# EAGLE schematic DevBit-MAX30102 (EAGLE 7.3.0)
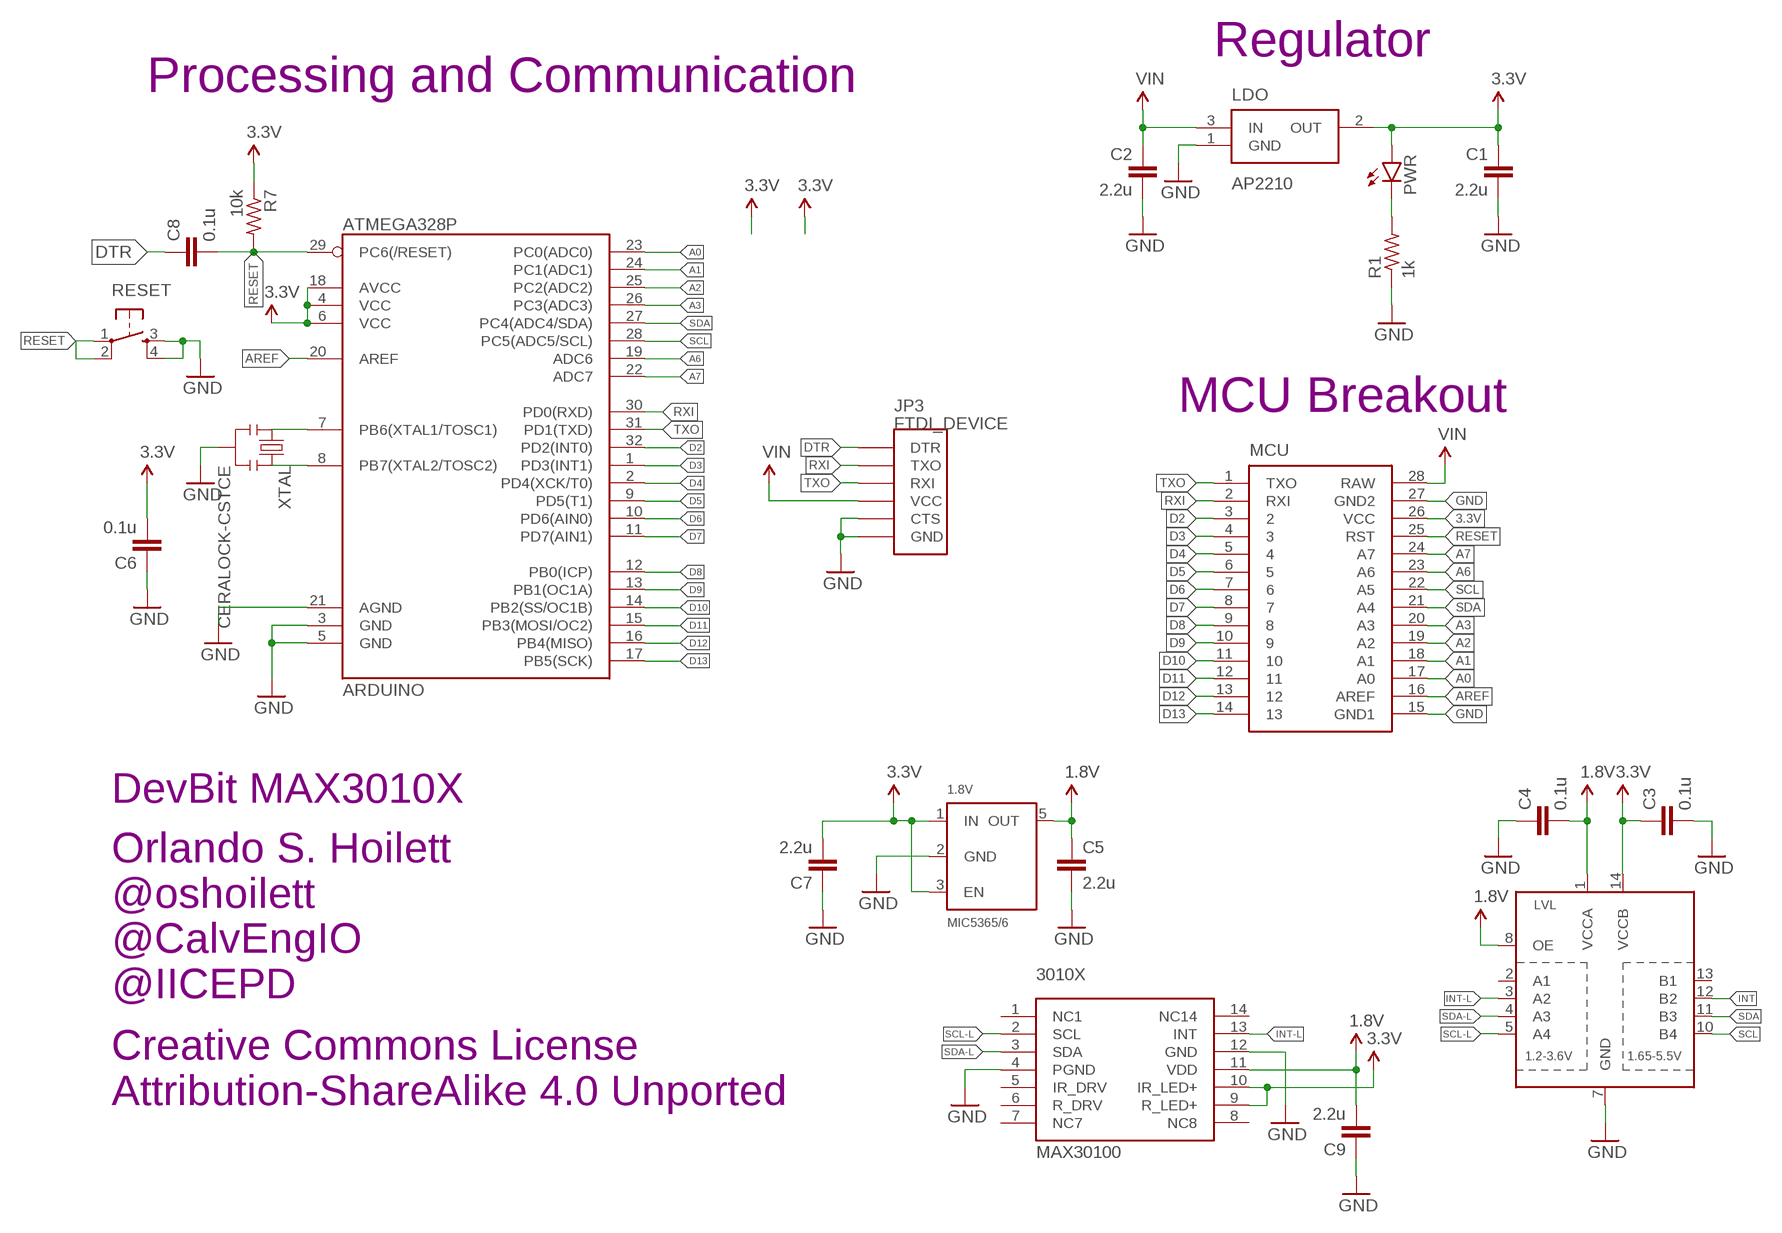
[diagram p0: schematic, sheet 1]

## Parts
1.8V  MIC5365/6  [SC-70-5]
3010X  MAX30100  [OESIP14]
ARDUINO  ATMEGA328P  ATMEGA328_SMT-OHMOD  [TQFP32-08]
C1  2.2u  C-EUC0402  [C0402]
C2  2.2u  C-EUC0402  [C0402]
C3  0.1u  C-EUC0402  [C0402]
C4  0.1u  C-EUC0402  [C0402]
C5  2.2u  C-EUC0402  [C0402]
C6  0.1u  C-EUC0402  [C0402]
C7  2.2u  C-EUC0402  [C0402]
C8  0.1u  C-EUC0402  [C0402]
C9  2.2u  C-EUC0402  [C0402]
JP3  FTDI_DEVICE  [FTDI_DEVICE]
LDO  AP2210  [SOT23]
LVL  TXB0104PWR  [TSSOP14]
MCU  DEVBASIC-V1  [DEVBIT-BASIC-V1]
PWR  LED0603  [LED-0603]
R1  1k  R-US_R0402  [R0402]
R7  10k  R-US_R0402  [R0402]
RESET  BUTTON-PTS830GG140  [BUTTON-GULLWING]
XTAL  CERALOCK-CSTCE  [RESONATOR-00]

## Nets
1.8V: 1.8V.5(OUT) 3010X.11(VDD) C4.2 C5.1 C9.2 LVL.1(VCCA) LVL.8(OE)
3.3V: 1.8V.1(IN) 1.8V.3(EN) 3010X.9(R_LED+) 3010X.10(IR_LED+) ARDUINO.4(VCC) ARDUINO.6(VCC) ARDUINO.18(AVCC) C1.1 C3.1 C6.2 C7.2 LDO.2(OUT) LVL.14(VCCB) MCU.26(VCC) PWR.A R7.1
A0: ARDUINO.23(PC0(ADC0)) MCU.17(A0)
A1: ARDUINO.24(PC1(ADC1)) MCU.18(A1)
A2: ARDUINO.25(PC2(ADC2)) MCU.19(A2)
A3: ARDUINO.26(PC3(ADC3)) MCU.20(A3)
A6: ARDUINO.19(ADC6) MCU.23(A6)
A7: ARDUINO.22(ADC7) MCU.24(A7)
AREF: ARDUINO.20(AREF) MCU.16(AREF)
D2: ARDUINO.32(PD2(INT0)) MCU.3
D3: ARDUINO.1(PD3(INT1)) MCU.4
D4: ARDUINO.2(PD4(XCK/T0)) MCU.5
D5: ARDUINO.9(PD5(T1)) MCU.6
D6: ARDUINO.10(PD6(AIN0)) MCU.7
D7: ARDUINO.11(PD7(AIN1)) MCU.8
D8: ARDUINO.12(PB0(ICP)) MCU.9
D9: ARDUINO.13(PB1(OC1A)) MCU.10
D10: ARDUINO.14(PB2(SS/OC1B)) MCU.11
D11: ARDUINO.15(PB3(MOSI/OC2)) MCU.12
D12: ARDUINO.16(PB4(MISO)) MCU.13
D13: ARDUINO.17(PB5(SCK)) MCU.14
DTR: C8.1 JP3.DTR
GND: 1.8V.2(GND) 3010X.4(PGND) 3010X.12(GND) ARDUINO.3(GND) ARDUINO.5(GND) ARDUINO.21(AGND) C1.2 C2.2 C3.2 C4.1 C5.2 C6.1 C7.1 C9.1 JP3.CTS JP3.GND LDO.1(GND) LVL.7(GND) MCU.15(GND1) MCU.27(GND2) R1.1 RESET.3 RESET.4 XTAL.2
INT: LVL.12(B2)
INT-L: 3010X.13(INT) LVL.3(A2)
N$1: ARDUINO.7(PB6(XTAL1/TOSC1)) XTAL.1
N$2: ARDUINO.8(PB7(XTAL2/TOSC2)) XTAL.3
N$3: PWR.C R1.2
RESET: ARDUINO.29(PC6(/RESET)) C8.2 MCU.25(RST) R7.2 RESET.1 RESET.2
RXI: ARDUINO.30(PD0(RXD)) JP3.TXO MCU.2(RXI)
SCL: ARDUINO.28(PC5(ADC5/SCL)) LVL.10(B4) MCU.22(A5)
SCL-L: 3010X.2(SCL) LVL.5(A4)
SDA: ARDUINO.27(PC4(ADC4/SDA)) LVL.11(B3) MCU.21(A4)
SDA-L: 3010X.3(SDA) LVL.4(A3)
TXO: ARDUINO.31(PD1(TXD)) JP3.RXI MCU.1(TXO)
VIN: C2.1 JP3.VCC LDO.3(IN) MCU.28(RAW)
Unconnected: 3010X.1(NC1) 3010X.5(IR_DRV) 3010X.6(R_DRV) 3010X.7(NC7) 3010X.8(NC8) 3010X.14(NC14) LVL.2(A1) LVL.13(B1)

## Notes on the sheet
- Regulator
- Processing and Communication
- MCU Breakout
- DevBit MAX3010X
- Orlando S. Hoilett
  @oshoilett
  @CalvEngIO
  @IICEPD
- Creative Commons License
  Attribution-ShareAlike 4.0 Unported

## Library data of the parts
1.8V = Orlando:MIC5365/6
3010X = OrlandoRonMod:MAX30100
ARDUINO = SparkFun-DigitalIC:ATMEGA328_SMT-OHMOD: 32-Pin Atmega328 part Commonly used on Arduino compatible boards Available in QFP and QFN packages TQFP is IC-09069 QFN is non-stock; PROD_ID: IC-09069
C1-C9 = resistor:C-EU: CAPACITOR, European symbol
JP3 = Orlando:FTDI_DEVICE
LDO = Orlando:AP2210
LVL = SparkFun-DigitalIC:TXB0104PWR: 4-Bit Bi-Directional Level Shifter 1.2V-3.6V (VCCA) to 1.65V-5.5V (VCCB) bi-directional level shifter with auto direction sensing. Max data rate - VCCA 1.8V: 20Mbps (50ns), VCCA 3.3V: 100Mbps (10ns) Digikey: 296-21929-1-ND (TSSOP) IC-11329
MCU = Orlando:DEVBASIC-V1
PWR = SparkFun-LED:LED: LEDs Standard schematic elements and footprints for 5mm, 3mm, 1206, and 0603 sized LEDs. 5mm - Spark Fun Electronics SKU : COM-00529 (and others)
R1 R7 = resistor:R-US_: RESISTOR, American symbol
RESET = Orlando:BUTTON-PTS830GG140
XTAL = Orlando:CERALOCK-CSTCE